# Altium project unisat_gs_hw.PrjPCB
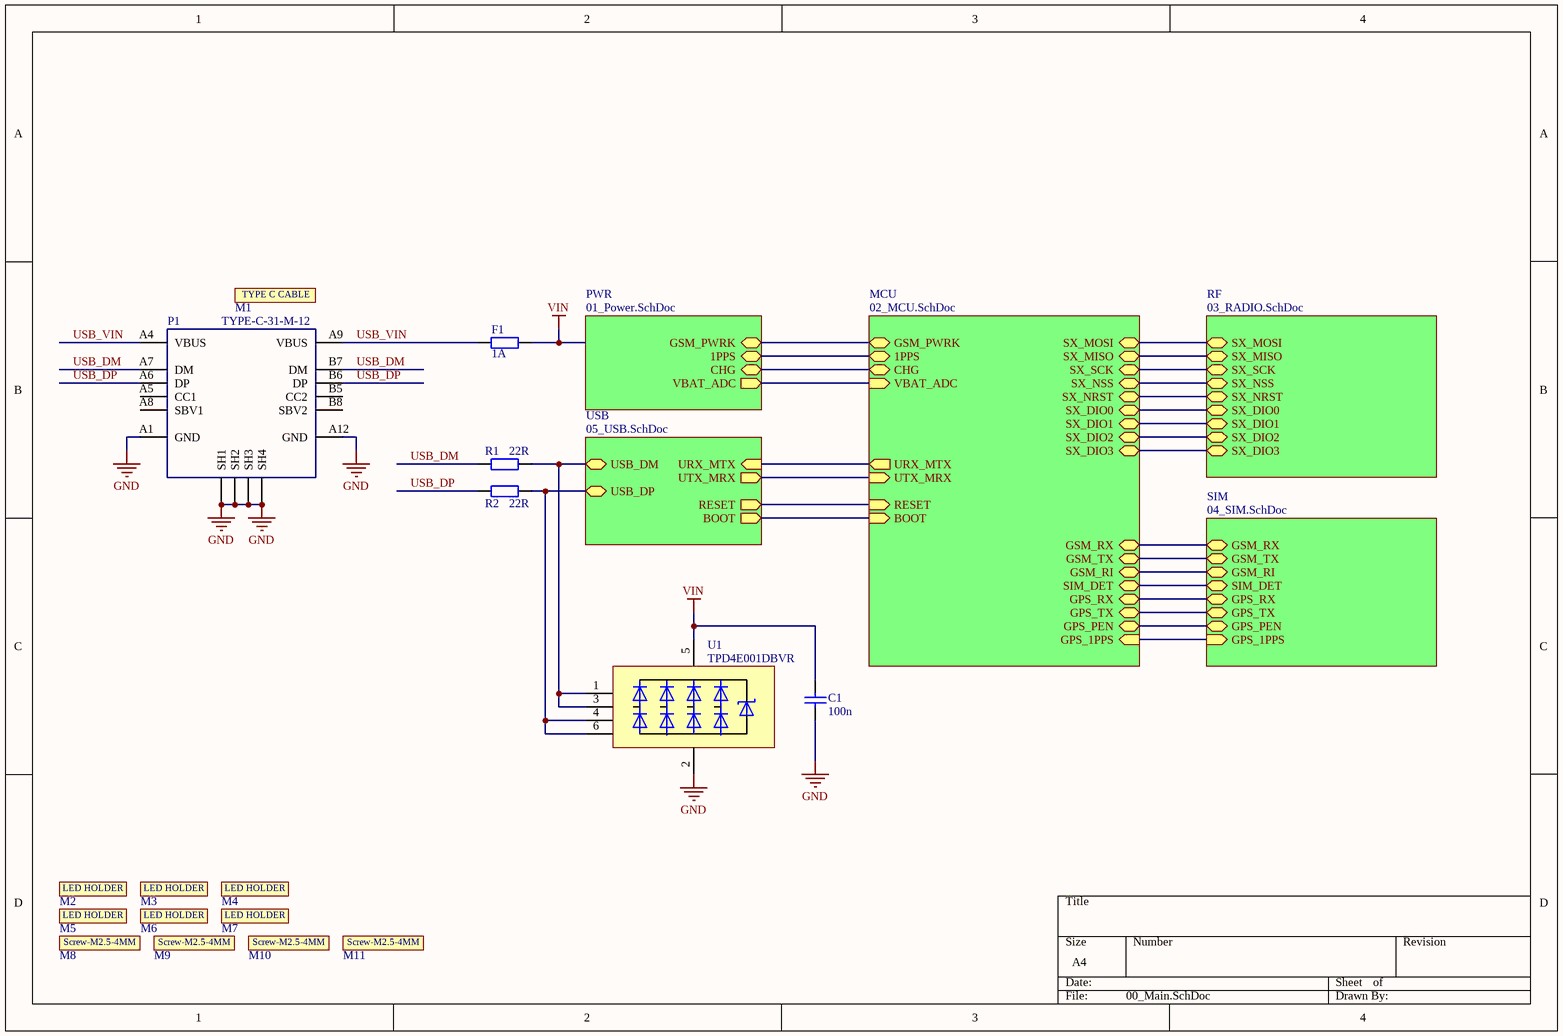
[diagram p0: 00_Main.SchDoc]
hwver: v02
5 sheets, 73 parts. Net scope: hierarchical (ports join the sheet entries above them; power ports are global).
Board file: unisat_gs_board.PcbDoc
Sheets:
  00_Main.SchDoc
    USB = 05_USB.SchDoc
    SIM = 04_SIM.SchDoc
    MCU = 02_MCU.SchDoc
    RF = 03_RADIO.SchDoc

## Sheet 00_Main.SchDoc
size A4

### Parts
C1  100n  [C0603_IPC_MD]
F1  1A  [R0603_IPC_MD]
M1  UGREEN-PVC-TYPE-C  (value not drawn)  (mechanical)
M2  LedHolderM3  (value not drawn)  (mechanical)
M3  LedHolderM3  (value not drawn)  (mechanical)
M4  LedHolderM3  (value not drawn)  (mechanical)
M5  C94096  [LED3MM_HOLDER]  (value not drawn)  (mechanical)
M6  C94096  [LED3MM_HOLDER]  (value not drawn)  (mechanical)
M7  C94096  [LED3MM_HOLDER]  (value not drawn)  (mechanical)
M8  ScrewST-M3-6MM  (value not drawn)  (mechanical)
M9  ScrewST-M3-6MM  (value not drawn)  (mechanical)
M10  ScrewST-M3-6MM  (value not drawn)  (mechanical)
M11  ScrewST-M3-6MM  (value not drawn)  (mechanical)
P1  TYPE-C-31-M-12  [TYPE-C-C165948]
R1  22R  [R0603_IPC_MD]
R2  22R  [R0603_IPC_MD]
U1  TPD4E001DBVR  [SOT23-6]

### Sub-sheets
MCU = 02_MCU.SchDoc: GSM_PWRK, URX_MTX (out), UTX_MRX (in), SX_MOSI, SX_MISO, SX_SCK, SX_NSS, SX_NRST, SX_DIO1, SX_DIO2, SX_DIO3, SX_DIO0, GSM_RX, GSM_TX, GSM_RI, GPS_RX, GPS_TX, GPS_PEN, GPS_1PPS (in), SIM_DET, 1PPS, CHG, RESET (in), BOOT (in), VBAT_ADC (in)
PWR = 01_Power.SchDoc (file not in this document): GSM_PWRK, 1PPS, CHG, VBAT_ADC (out)
RF = 03_RADIO.SchDoc: SX_MOSI, SX_MISO, SX_SCK, SX_NSS, SX_NRST, SX_DIO0, SX_DIO1, SX_DIO2, SX_DIO3
SIM = 04_SIM.SchDoc: GSM_RX, GSM_TX, GSM_RI, GPS_RX, GPS_TX, GPS_PEN, GPS_1PPS (in), SIM_DET
USB = 05_USB.SchDoc: USB_DP, USB_DM, URX_MTX (in), UTX_MRX (out), RESET (out), BOOT (out)

### Nets
GND: C1.2 P1.A1(GND) P1.A12(GND) P1.SH1 P1.SH2 P1.SH3 P1.SH4 U1.2(GND)
VIN: C1.1 F1.2 U1.5(VCC)
BOOT: sheet USB/BOOT, sheet MCU/BOOT
RESET: sheet USB/RESET, sheet MCU/RESET
SIM_DET: sheet SIM/SIM_DET, sheet MCU/SIM_DET
SX_DIO0: sheet MCU/SX_DIO0, sheet RF/SX_DIO0
SX_DIO1: sheet MCU/SX_DIO1, sheet RF/SX_DIO1
SX_DIO2: sheet MCU/SX_DIO2, sheet RF/SX_DIO2
SX_DIO3: sheet MCU/SX_DIO3, sheet RF/SX_DIO3
SX_MISO: sheet MCU/SX_MISO, sheet RF/SX_MISO
SX_MOSI: sheet MCU/SX_MOSI, sheet RF/SX_MOSI
SX_NRST: sheet MCU/SX_NRST, sheet RF/SX_NRST
SX_NSS: sheet MCU/SX_NSS, sheet RF/SX_NSS
SX_SCK: sheet MCU/SX_SCK, sheet RF/SX_SCK
URX_MTX: sheet USB/URX_MTX, sheet MCU/URX_MTX
USB_DM: P1.A7(DM) P1.B7(DM) R1.1
USB_DP: P1.A6(DP) P1.B6(DP) R2.1
USB_VIN: F1.1 P1.A4(VBUS) P1.A9(VBUS)
UTX_MRX: sheet USB/UTX_MRX, sheet MCU/UTX_MRX
NetR1_2: R1.2 U1.1(IO1) U1.3(IO2) ; sheet USB/USB_DM
NetR2_2: R2.2 U1.4(IO3) U1.6(IO4) ; sheet USB/USB_DP
NetR21_1: sheet SIM/GSM_RI, sheet MCU/GSM_RI
NetR22_1: sheet SIM/GSM_RX, sheet MCU/GSM_RX
NetR23_1: sheet SIM/GSM_TX, sheet MCU/GSM_TX
NetR26_1: sheet SIM/GPS_PEN, sheet MCU/GPS_PEN
NetR29_1: sheet SIM/GPS_1PPS, sheet MCU/GPS_1PPS
NetR30_1: sheet SIM/GPS_RX, sheet MCU/GPS_RX
NetR31_1: sheet SIM/GPS_TX, sheet MCU/GPS_TX
NetU4_11: sheet PWR/VBAT_ADC, sheet MCU/VBAT_ADC
NetU4_44: sheet PWR/CHG, sheet MCU/CHG
NetU4_45: sheet PWR/GSM_PWRK, sheet MCU/GSM_PWRK
NetU4_61: sheet PWR/1PPS, sheet MCU/1PPS

Not connected (* = marked no-connect by the designer): P1 A5(CC1) A8(SBV1) B5(CC2) B8(SBV2)

### Notes on the sheet
- (in symbol C94096) LED HOLDER
- (in symbol LED-HOLDER-M3) LED HOLDER
- (in symbol ScrewST-M3-6MM) Screw-M2.5-4MM
- (in symbol TYPE-C-CABLE) TYPE C CABLE

### Library data of the parts
C1 = CL10B104KO8NNNC: CAP CER 0.1UF 16V X7R 0603; Manufacturer: Samsung Electro-Mechanics; Manufacturer Part Number: CL10B104KO8NNNC; Voltage: 16V; Value: 100n; Dielectric: X7R; Supplier 1: Digi-Key; Supplier Part Number 1: 1276-1005-1-ND
F1 = MFU0603FF01000P500: FUSE BOARD MOUNT 1A 32VDC 0603; Manufacturer: Bourns Inc.; Value: 1A; Manufacturer Part Number: MFU0603FF01000P500; Supplier 1: Digi-Key; Supplier Part Number 1: 749-1742-1-ND
M1 = TYPE-C-CABLE: Ugreen USB Type C Cable; Manufacturer: China; Manufacturer Part Number: UGREEN-PVC-TYPE-C; Supplier 1: Aliexpress; Supplier Part Number 1: UGREEN-PVC-TYPE-C; Link: https://www.aliexpress.com/item/32421088643.html?spm=2114.12010612.8148356.8.24b5310anwdN5o
M2-M4 = LED-HOLDER-M3: Manufacturer: China; Manufacturer Part Number: LedHolderM3; Supplier 1: Aliexpress; Supplier Part Number 1: LedHolderM3
M5-M7 = C94096: LED Light Pipes 4*10 RoHS; Manufacturer: HIWA; Manufacturer Part Number: C94096; Supplier 1: LCSC; Supplier Part Number 1: C94096
M8-M11 = ScrewST-M3-6MM: Manufacturer: China; Manufacturer Part Number: ScrewST-M3-6MM; Supplier 1: Aliexpress; Supplier Part Number 1: ScrewST-M3-6MM
P1 = TYPE-C-31-M-12: TYPE C PCB TH CONN; Manufacturer: Korean Hroparts Elec; Manufacturer Part Number: TYPE-C-31-M-12; Supplier 1: LCSC; Supplier Part Number 1: C165948
R1 R2 = CR0603-JW-220ELF: RES SMD 22 OHM 5% 1/10W 0603; Manufacturer: Bourns Inc.; Value: 22R; Tolarance: 5%; Manufacturer Part Number: CR0603-JW-220ELF; Supplier 1: Digi-Key; Supplier Part Number 1: CR0603-JW-220ELFCT-ND
U1 = TPD4E001DBVR: 4x TVS DIODE 5.5V SOT23-6; Manufacturer: TI; Manufacturer Part Number: TPD4E001DBVR; Supplier 1: Digi-Key; Supplier Part Number 1: 296-28203-1-ND

## Sheet 05_USB.SchDoc
size A4; Revision: A
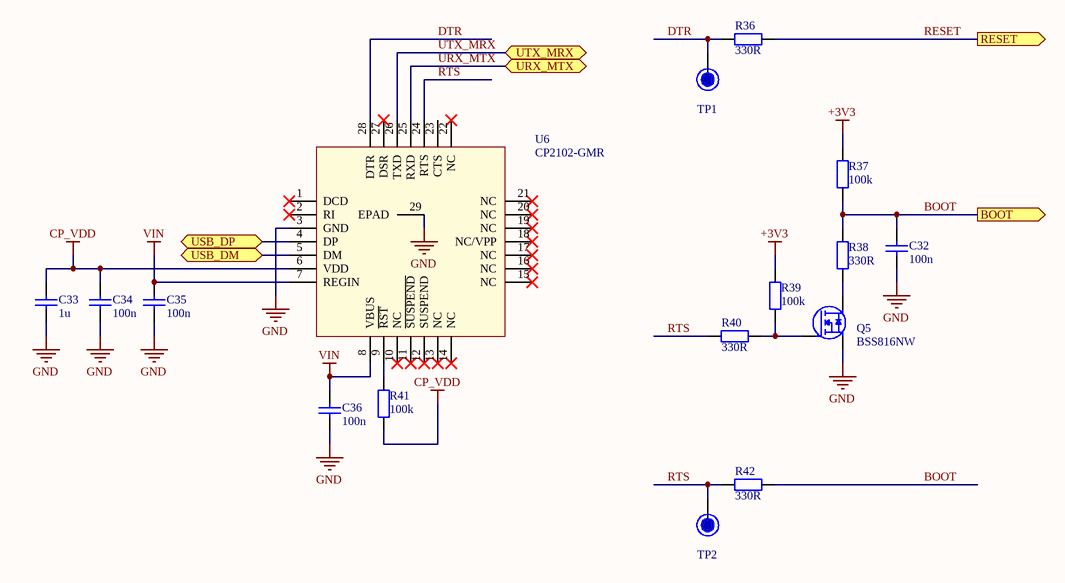
[diagram p1: 05_USB.SchDoc]

### Parts
C32  100n  [C0603_IPC_MD]  (no BOM)
C33  1u  [C0603_IPC_MD]
C34  100n  [C0603_IPC_MD]
C35  100n  [C0603_IPC_MD]
C36  100n  [C0603_IPC_MD]
Q5  BSS816NW  [SOT323]  (no BOM)
R36  330R  [R0603_IPC_MD]
R37  100k  [R0603_IPC_MD]  (no BOM)
R38  330R  [R0603_IPC_MD]  (no BOM)
R39  100k  [R0603_IPC_MD]  (no BOM)
R40  330R  [R0603_IPC_MD]  (no BOM)
R41  100k  [R0603_IPC_MD]
R42  330R  [R0603_IPC_MD]
TP1  RTS  [TestPoint_1M5]  (value not drawn)  (no BOM)
TP2  DTR  [TestPoint_1M5]  (value not drawn)  (no BOM)
U6  CP2102-GMR  [QFN28_(SL)]

### Ports
BOOT (out), RESET (out), URX_MTX, USB_DM, USB_DP, UTX_MRX

### Nets
+3V3: R37.2 R39.2
CP_VDD: C33.2 C34.2 R41.1 U6.6(VDD)
GND: C32.1 C33.1 C34.1 C35.1 C36.1 Q5.2(S) U6.3(GND) U6.29(EPAD)
VIN: C35.2 C36.2 U6.7(REGIN) U6.8(VBUS)
BOOT: C32.2 R37.1 R38.1 R42.2 ; port BOOT
DTR: R36.2 TP1.0 U6.28(DTR)
RESET: R36.1 ; port RESET
RTS: R40.1 R42.1 TP2.0 U6.24(RTS)
URX_MTX: U6.25(RXD) ; port URX_MTX
UTX_MRX: U6.26(TXD) ; port UTX_MRX
NetQ5_1: Q5.1(G) R39.1 R40.2
NetQ5_3: Q5.3(D) R38.2
NetR1_2: U6.5(DM) ; port USB_DM
NetR2_2: U6.4(DP) ; port USB_DP
NetR41_2: R41.2 U6.9(~{RST})

Not connected (* = marked no-connect by the designer): U6 1(DCD)* 2(RI)* 10(NC)* 11(~{SUSPEND})* 12(SUSPEND)* 13(NC)* 14(NC)* 15(NC)* 16(NC)* 17(NC)* 18(NC/VPP)* 19(NC)* 20(NC)* 21(NC)* 22(NC)* 23(CTS) 27(DSR)*

### Notes on the sheet
- Title
- Size:
- Date:
- A4
- Number:
- Time:
- Revision:
- Sheet
- of
- File:

### Library data of the parts
C32 C34-C36 = CL10B104KO8NNNC: as C1 on sheet 00_Main; Manufacturer Part Number: CL10B104KO8NNNC; Voltage: 16V; Value: 100n; Dielectric: X7R; Supplier 1: Digi-Key; Supplier Part Number 1: 1276-1005-1-ND
C33 = CL10B105MO8NNWC: CAP CER 1UF 16V X7R 0603; Manufacturer: Samsung Electro-Mechanics; Manufacturer Part Number: CL10B105MO8NNWC; Voltage: 16V; Value: 1u; Dielectric: X7R; Supplier 1: Digi-Key; Supplier Part Number 1: 1276-6524-1-ND
Q5 = BSS816: N-Channel Logic Level Enhancement Mode Field Effect Transistor; Manufacturer: Infineon Technologies; Manufacturer Part Number: BSS816NW; Supplier 1: Digi-Key; Supplier Part Number 1: BSS816NWH6327XTSA1CT-ND
R36 R38 R40 R42 = CR0603-JW-331ELF: RES SMD 330 OHM 5% 1/10W 0603; Manufacturer: Bourns Inc.; Value: 330R; Tolarance: 5%; Manufacturer Part Number: CR0603-JW-331ELF; Supplier 1: Digi-Key; Supplier Part Number 1: CR0603-JW-331ELFCT-ND
R37 R39 R41 = RMCF0603FT100K: RES 100K OHM 1% 1/10W 0603; Manufacturer: Bourns Inc.; Value: 100k; Tolarance: 1%; Manufacturer Part Number: RMCF0603FT100K; Supplier 1: Digi-Key; Supplier Part Number 1: RMCF0603FT100KCT-ND
TP1 TP2 = TP: Test Point
U6 = CP2102-GMR: IC USB-TO-UART BRIDGE 28VQFN; Manufacturer: Silicon Labs; Manufacturer Part Number: CP2102-GMR; Supplier 1: Digi-Key; Supplier Part Number 1: 336-1160-1-ND

## Sheet 04_SIM.SchDoc
size A4
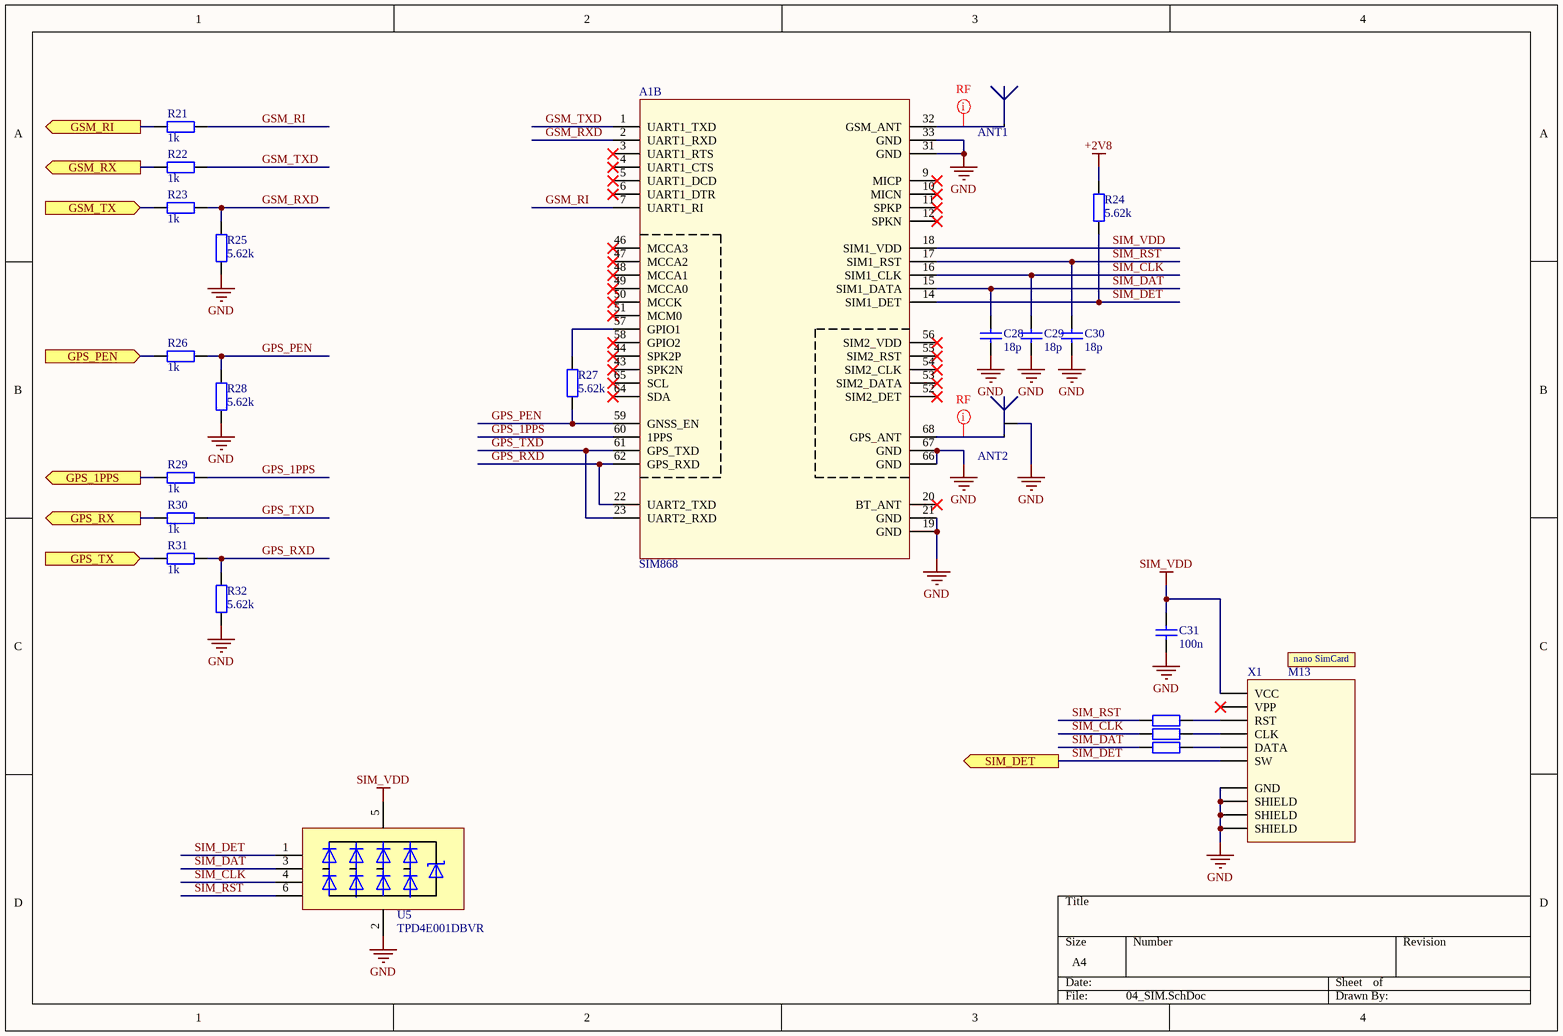
[diagram p2: 04_SIM.SchDoc]

### Parts
A1  SIM868  [SIM868]  (part B of 2)
ANT1  W3070  [W3070]  (value not drawn)
ANT2  ANT3216LL15R1575A  [ANT3216LL15]  (value not drawn)
C28  18p  [C0603_IPC_MD]
C29  18p  [C0603_IPC_MD]
C30  18p  [C0603_IPC_MD]
C31  100n  [C0603_IPC_MD]
M13  SIMCARD-NANO  (value not drawn)  (mechanical)
R21  1k  [R0603_IPC_MD]
R22  1k  [R0603_IPC_MD]
R23  1k  [R0603_IPC_MD]
R24  5.62k  [R0603_IPC_MD]
R25  5.62k  [R0603_IPC_MD]
R26  1k  [R0603_IPC_MD]
R27  5.62k  [R0603_IPC_MD]
R28  5.62k  [R0603_IPC_MD]
R29  1k  [R0603_IPC_MD]
R30  1k  [R0603_IPC_MD]
R31  1k  [R0603_IPC_MD]
R32  5.62k  [R0603_IPC_MD]
R33  22R  [R0603_IPC_MD]  (value not drawn)
R34  22R  [R0603_IPC_MD]  (value not drawn)
R35  22R  [R0603_IPC_MD]  (value not drawn)
U5  TPD4E001DBVR  [SOT23-6]
X1  SNO-1305-B  [SNO-1305-B]  (value not drawn)

### Ports
GPS_1PPS (out), GPS_PEN (in), GPS_RX (out), GPS_TX (in), GSM_RI (out), GSM_RX (out), GSM_TX (in), SIM_DET (out)

### Nets
+2V8: R24.2
GND: A1.19(GND) A1.21(GND) A1.31(GND) A1.33(GND) A1.66(GND) A1.67(GND) ANT2.2 C28.1 C29.1 C30.1 C31.1 R25.1 R28.1 R32.1 U5.2(GND) X1.C5(GND) X1.S1(SHIELD) X1.S2(SHIELD) X1.S3(SHIELD)
SIM_VDD: A1.18(SIM1_VDD) C31.2 U5.5(VCC) X1.C1(VCC)
GPS_1PPS: A1.60(1PPS) R29.2
GPS_PEN: A1.59(GNSS_EN) R26.2 R27.1 R28.2
GPS_RXD: A1.22(UART2_TXD) A1.62(GPS_RXD) R31.2 R32.2
GPS_TXD: A1.23(UART2_RXD) A1.61(GPS_TXD) R30.2
GSM_RI: A1.7(UART1_RI) R21.2
GSM_RXD: A1.2(UART1_RXD) R23.2 R25.2
GSM_TXD: A1.1(UART1_TXD) R22.2
SIM_CLK: A1.16(SIM1_CLK) C29.2 R34.1 U5.4(IO3)
SIM_DAT: A1.15(SIM1_DATA) C28.2 R35.1 U5.3(IO2)
SIM_DET: A1.14(SIM1_DET) R24.1 U5.1(IO1) X1.SW ; port SIM_DET
SIM_RST: A1.17(SIM1_RST) C30.2 R33.1 U5.6(IO4)
NetA1_32: A1.32(GSM_ANT) ANT1.1
NetA1_57: A1.57(GPIO1) R27.2
NetA1_68: A1.68(GPS_ANT) ANT2.1
NetR21_1: R21.1 ; port GSM_RI
NetR22_1: R22.1 ; port GSM_RX
NetR23_1: R23.1 ; port GSM_TX
NetR26_1: R26.1 ; port GPS_PEN
NetR29_1: R29.1 ; port GPS_1PPS
NetR30_1: R30.1 ; port GPS_RX
NetR31_1: R31.1 ; port GPS_TX
NetR33_2: R33.2 X1.C2(RST)
NetR34_2: R34.2 X1.C3(CLK)
NetR35_2: R35.2 X1.C7(DATA)

Not connected (* = marked no-connect by the designer): A1 3(UART1_RTS)* 4(UART1_CTS)* 5(UART1_DCD)* 6(UART1_DTR)* 9(MICP)* 10(MICN)* 11(SPKP)* 12(SPKN)* 20(BT_ANT)* 43(SPK2N)* 44(SPK2P)* 46(MCCA3)* 47(MCCA2)* 48(MCCA1)* 49(MCCA0)* 50(MCCK)* 51(MCM0)* 52(SIM2_DET)* 53(SIM2_DATA)* 54(SIM2_CLK)* 55(SIM2_RST)* 56(SIM2_VDD)* 58(GPIO2)* 64(SDA)* 65(SCL)*; X1 C6(VPP)*

### Layout directives
net class RF50: NetA1_32, NetA1_68

### Notes on the sheet
- (in symbol SIMCARD-NANO) nano SimCard

### Library data of the parts
A1 = SIM868: GSM & GPRS & GPS Modules PCBModule RoHS; Manufacturer: SIMCom Wireless Solutions; Manufacturer Part Number: SIM868; Supplier 1: LCSC; Supplier Part Number 1: C89549
ANT1 = W3070: RF ANT 900MHZ/1.8GHZ CHIP SLD; Manufacturer: PulseLarsen Antennas; Manufacturer Part Number: W3070; Supplier 1: Digi-Key; Supplier Part Number 1: 553-1695-1-ND
ANT2 = ANT3216LL15R1575A: RF ANT 1.575GHZ CHIP SOLDER SMD; Manufacturer: Yageo; Manufacturer Part Number: ANT3216LL15R1575A; Supplier 1: Digi-Key; Supplier Part Number 1: 311-1543-1-ND
C28-C30 = CL10C180JB8NNNC: CAP CER 18PF 50V C0G/NP0 0603; Manufacturer: Samsung Electro-Mechanics; Manufacturer Part Number: CL10C180JB8NNNC; Voltage: 50V; Value: 18p; Dielectric: C0G/NP0; Supplier 1: Digi-Key; Supplier Part Number 1: 1276-1089-1-ND
C31 = CL10B104KO8NNNC: as C1 on sheet 00_Main; Manufacturer Part Number: CL10B104KO8NNNC; Voltage: 16V; Value: 100n; Dielectric: X7R; Supplier 1: Digi-Key; Supplier Part Number 1: 1276-1005-1-ND
M13 = SIMCARD-NANO: Nano SimCard; Manufacturer: Beeline; Manufacturer Part Number: SIMCARD-NANO; Supplier 1: Beeline; Supplier Part Number 1: SIMCARD-NANO
R21-R23 R26 R29-R31 = CR0603-JW-102ELF: RES SMD 1K OHM 5% 1/10W 0603; Manufacturer: Bourns Inc.; Value: 1k; Tolarance: 5%; Manufacturer Part Number: CR0603-JW-102ELF; Supplier 1: Digi-Key; Supplier Part Number 1: CR0603-JW-102ELFCT-ND
R24 R25 R27 R28 R32 = CR0603-JW-5.62kR: RES 5.62K OHM 1% 1/10W 0603; Manufacturer: Stackpole Electronics Inc; Manufacturer Part Number: RMCF0603FT5K62; Value: 5.62k; Tolarance: ±1%; Supplier 1: Digi-Key; Supplier Part Number 1: RMCF0603FT5K62CT-ND
R33-R35 = CR0603-JW-220ELF: as R1 on sheet 00_Main; Value: 22R; Tolarance: 5%; Manufacturer Part Number: CR0603-JW-220ELF; Supplier 1: Digi-Key; Supplier Part Number 1: CR0603-JW-220ELFCT-ND
U5 = TPD4E001DBVR: as U1 on sheet 00_Main; Manufacturer Part Number: TPD4E001DBVR; Supplier 1: Digi-Key; Supplier Part Number 1: 296-28203-1-ND
X1 = SNO-1305-B: Hinged Sim Card Connector. With 6 contacts, with switch for card detection. Profile above PCB is 1.43mm.; Manufacturer: SOFNG; Manufacturer Part Number: SNO-1305-B; Supplier 1: LCSC; Supplier Part Number 1: C111371

## Sheet 02_MCU.SchDoc
size A4
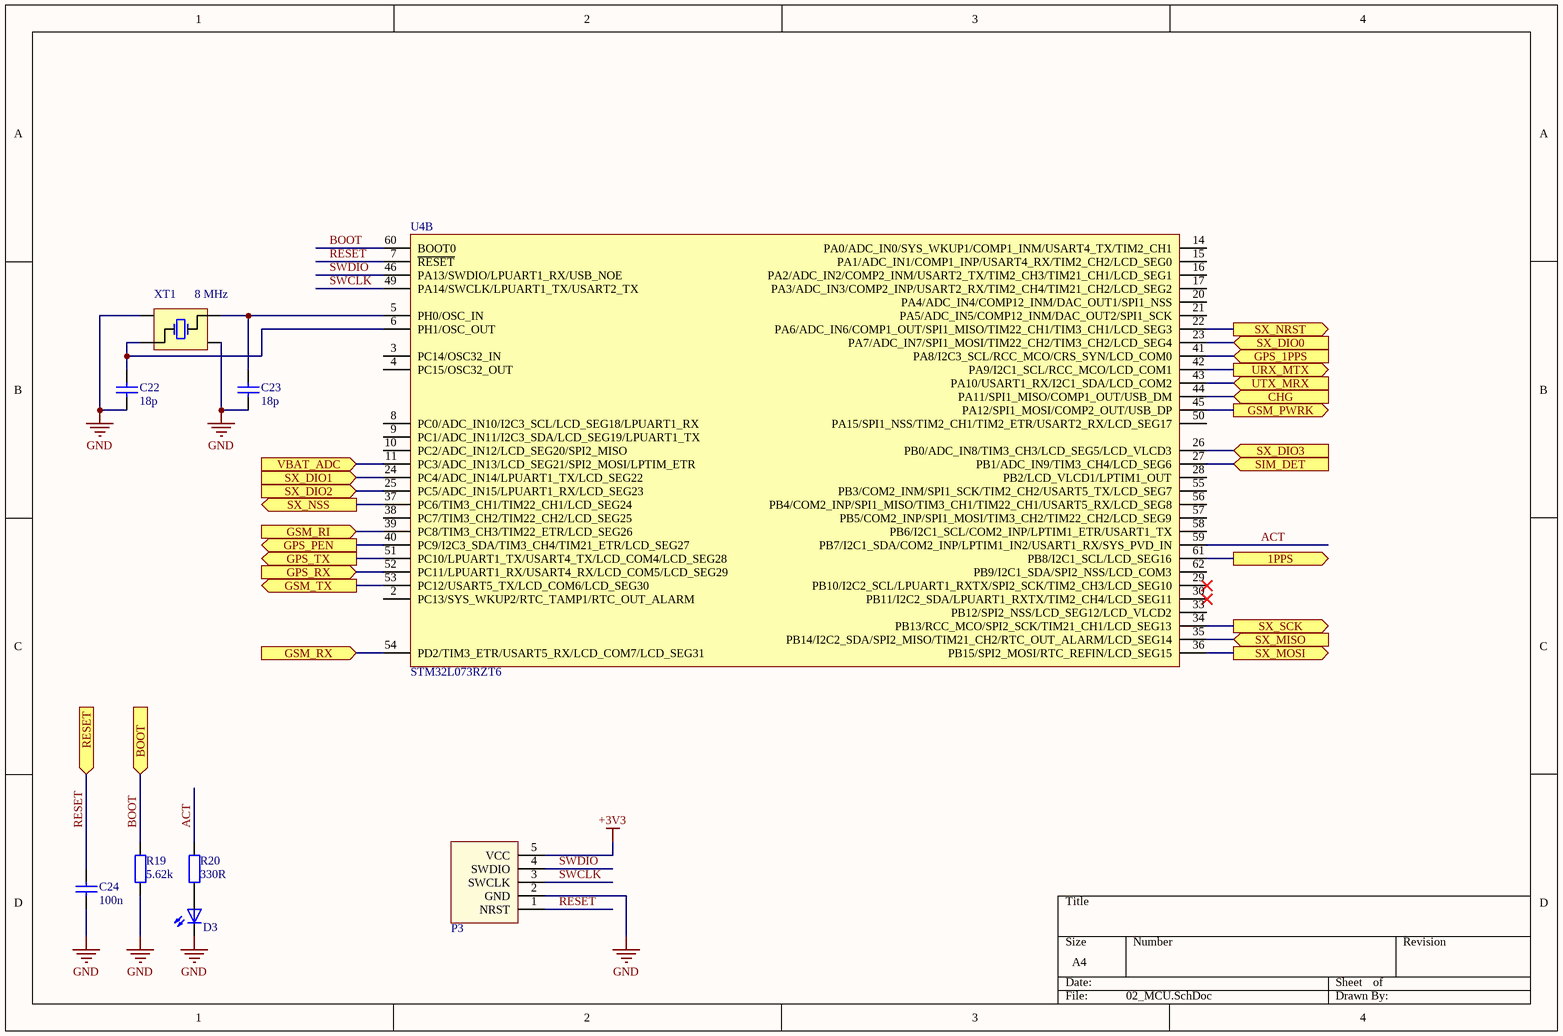
[diagram p3: 02_MCU.SchDoc]

### Parts
C22  18p  [C0603_IPC_MD]
C23  18p  [C0603_IPC_MD]
C24  100n  [C0603_IPC_MD]
D3  LTL-4231N  [LED3MM_HOLDER]  (value not drawn)
P3  SWD  [SWD_CON_VAR2]  (value not drawn)  (no BOM)
R19  5.62k  [R0603_IPC_MD]
R20  330R  [R0603_IPC_MD]
U4  STM32L073RZT6  [LQFP64_10X10MM]  (part B of 2)
XT1  8 MHz  [5.0X3.2_4PAD_SMT]

### Ports
1PPS (out), BOOT (in), CHG (in), GPS_1PPS (in), GPS_PEN (out), GPS_RX (in), GPS_TX (out), GSM_PWRK (out), GSM_RI (in), GSM_RX (in), GSM_TX (out), RESET (in), SIM_DET (in), SX_DIO0 (in), SX_DIO1 (in), SX_DIO2 (in), SX_DIO3 (in), SX_MISO (in), SX_MOSI (out), SX_NRST (out), SX_NSS (out), SX_SCK (out), URX_MTX (out), UTX_MRX (in), VBAT_ADC (in)

### Nets
+3V3: P3.5(VCC)
GND: C22.1 C23.1 C24.1 D3.1(C) P3.2(GND) R19.1 XT1.2(NC) XT1.4(NC)
ACT: R20.1 U4.59(PB7/I2C1_SDA/COM2_INP/LPTIM1_IN2/USART1_RX/SYS_PVD_IN)
BOOT: R19.2 U4.60(BOOT0) ; port BOOT
RESET: C24.2 P3.1(NRST) U4.7(~{RESET}) ; port RESET
SIM_DET: U4.27(PB1/ADC_IN9/TIM3_CH4/LCD_SEG6) ; port SIM_DET
SWCLK: P3.3(SWCLK) U4.49(PA14/SWCLK/LPUART1_TX/USART2_TX)
SWDIO: P3.4(SWDIO) U4.46(PA13/SWDIO/LPUART1_RX/USB_NOE)
SX_DIO0: U4.23(PA7/ADC_IN7/SPI1_MOSI/TIM22_CH2/TIM3_CH2/LCD_SEG4) ; port SX_DIO0
SX_DIO1: U4.24(PC4/ADC_IN14/LPUART1_TX/LCD_SEG22) ; port SX_DIO1
SX_DIO2: U4.25(PC5/ADC_IN15/LPUART1_RX/LCD_SEG23) ; port SX_DIO2
SX_DIO3: U4.26(PB0/ADC_IN8/TIM3_CH3/LCD_SEG5/LCD_VLCD3) ; port SX_DIO3
SX_MISO: U4.35(PB14/I2C2_SDA/SPI2_MISO/TIM21_CH2/RTC_OUT_ALARM/LCD_SEG14) ; port SX_MISO
SX_MOSI: U4.36(PB15/SPI2_MOSI/RTC_REFIN/LCD_SEG15) ; port SX_MOSI
SX_NRST: U4.22(PA6/ADC_IN6/COMP1_OUT/SPI1_MISO/TIM22_CH1/TIM3_CH1/LCD_SEG3) ; port SX_NRST
SX_NSS: U4.37(PC6/TIM3_CH1/TIM22_CH1/LCD_SEG24) ; port SX_NSS
SX_SCK: U4.34(PB13/RCC_MCO/SPI2_SCK/TIM21_CH1/LCD_SEG13) ; port SX_SCK
URX_MTX: U4.42(PA9/I2C1_SCL/RCC_MCO/LCD_COM1) ; port URX_MTX
UTX_MRX: U4.43(PA10/USART1_RX/I2C1_SDA/LCD_COM2) ; port UTX_MRX
NetC22_2: C22.2 U4.6(PH1/OSC_OUT) XT1.1(OSC1)
NetC23_2: C23.2 U4.5(PH0/OSC_IN) XT1.3(OSC2)
NetD3_2: D3.2(A) R20.2
NetR21_1: U4.39(PC8/TIM3_CH3/TIM22_ETR/LCD_SEG26) ; port GSM_RI
NetR22_1: U4.54(PD2/TIM3_ETR/USART5_RX/LCD_COM7/LCD_SEG31) ; port GSM_RX
NetR23_1: U4.53(PC12/USART5_TX/LCD_COM6/LCD_SEG30) ; port GSM_TX
NetR26_1: U4.40(PC9/I2C3_SDA/TIM3_CH4/TIM21_ETR/LCD_SEG27) ; port GPS_PEN
NetR29_1: U4.41(PA8/I2C3_SCL/RCC_MCO/CRS_SYN/LCD_COM0) ; port GPS_1PPS
NetR30_1: U4.52(PC11/LPUART1_RX/USART4_RX/LCD_COM5/LCD_SEG29) ; port GPS_RX
NetR31_1: U4.51(PC10/LPUART1_TX/USART4_TX/LCD_COM4/LCD_SEG28) ; port GPS_TX
NetU4_11: U4.11(PC3/ADC_IN13/LCD_SEG21/SPI2_MOSI/LPTIM_ETR) ; port VBAT_ADC
NetU4_44: U4.44(PA11/SPI1_MISO/COMP1_OUT/USB_DM) ; port CHG
NetU4_45: U4.45(PA12/SPI1_MOSI/COMP2_OUT/USB_DP) ; port GSM_PWRK
NetU4_61: U4.61(PB8/I2C1_SCL/LCD_SEG16) ; port 1PPS

Not connected (* = marked no-connect by the designer): U4 2(PC13/SYS_WKUP2/RTC_TAMP1/RTC_OUT_ALARM) 3(PC14/OSC32_IN) 4(PC15/OSC32_OUT) 8(PC0/ADC_IN10/I2C3_SCL/LCD_SEG18/LPUART1_RX) 9(PC1/ADC_IN11/I2C3_SDA/LCD_SEG19/LPUART1_TX) 10(PC2/ADC_IN12/LCD_SEG20/SPI2_MISO) 14(PA0/ADC_IN0/SYS_WKUP1/COMP1_INM/USART4_TX/TIM2_CH1) 15(PA1/ADC_IN1/COMP1_INP/USART4_RX/TIM2_CH2/LCD_SEG0) 16(PA2/ADC_IN2/COMP2_INM/USART2_TX/TIM2_CH3/TIM21_CH1/LCD_SEG1) 17(PA3/ADC_IN3/COMP2_INP/USART2_RX/TIM2_CH4/TIM21_CH2/LCD_SEG2) 20(PA4/ADC_IN4/COMP12_INM/DAC_OUT1/SPI1_NSS) 21(PA5/ADC_IN5/COMP12_INM/DAC_OUT2/SPI1_SCK) 28(PB2/LCD_VLCD1/LPTIM1_OUT) 29(PB10/I2C2_SCL/LPUART1_RXTX/SPI2_SCK/TIM2_CH3/LCD_SEG10)* 30(PB11/I2C2_SDA/LPUART1_RXTX/TIM2_CH4/LCD_SEG11)* 33(PB12/SPI2_NSS/LCD_SEG12/LCD_VLCD2) 38(PC7/TIM3_CH2/TIM22_CH2/LCD_SEG25) 50(PA15/SPI1_NSS/TIM2_CH1/TIM2_ETR/USART2_RX/LCD_SEG17) 55(PB3/COM2_INM/SPI1_SCK/TIM2_CH2/USART5_TX/LCD_SEG7) 56(PB4/COM2_INP/SPI1_MISO/TIM3_CH1/TIM22_CH1/USART5_RX/LCD_SEG8) 57(PB5/COM2_INP/SPI1_MOSI/TIM3_CH2/TIM22_CH2/LCD_SEG9) 58(PB6/I2C1_SCL/COM2_INP/LPTIM1_ETR/USART1_TX) 62(PB9/I2C1_SDA/SPI2_NSS/LCD_COM3)

### Library data of the parts
C22 C23 = CL10C180JB8NNNC: as C28 on sheet 04_SIM; Manufacturer Part Number: CL10C180JB8NNNC; Voltage: 50V; Value: 18p; Dielectric: C0G/NP0; Supplier 1: Digi-Key; Supplier Part Number 1: 1276-1089-1-ND
C24 = CL10B104KO8NNNC: as C1 on sheet 00_Main; Manufacturer Part Number: CL10B104KO8NNNC; Voltage: 16V; Value: 100n; Dielectric: X7R; Supplier 1: Digi-Key; Supplier Part Number 1: 1276-1005-1-ND
D3 = LTL-4231N: Light Emitting Diodes (LED) Green 569nm 12.6mcd@10mA Top View DIP3mm RoHS; Manufacturer: Lite-On; Manufacturer Part Number: LTL-4231N; Supplier 1: LCSC; Supplier Part Number 1: C125082
P3 = SWD-CONNECTOR_VAR1: SWDIO SWCLK VDD GND NRST; Manufacturer: *; Manufacturer Part Number: *; Supplier 1: *; Supplier Part Number 1: *
R19 = CR0603-JW-5.62kR: as R24 on sheet 04_SIM; Value: 5.62k; Tolarance: ±1%; Supplier 1: Digi-Key; Supplier Part Number 1: RMCF0603FT5K62CT-ND
R20 = CR0603-JW-331ELF: as R36 on sheet 05_USB; Value: 330R; Tolarance: 5%; Manufacturer Part Number: CR0603-JW-331ELF; Supplier 1: Digi-Key; Supplier Part Number 1: CR0603-JW-331ELFCT-ND
U4 = STM32L073RZT6: Ultra-low-power 32-bit MCU ARM®-based Cortex®-M0+; Manufacturer: ST; SRAM: 20KB; FLASH: 192KB; Manufacturer Part Number: STM32L073RZT6; Supplier 1: Digi-Key; Supplier Part Number 1: 497-16270-ND
XT1 = ABM3B-8.000MHZ-10-1-U-T: 8MHz ±10ppm Crystal 10pF 200 Ohms 4-SMD, No Lead; Manufacturer: Abracon LLC; Manufacturer Part Number: ABM3B-8.000MHZ-10-1-U-T; Type: XTAL; Value: 8 MHz; Supplier 1: Digi-Key; Supplier Part Number 1: 535-9721-1-ND

## Sheet 03_RADIO.SchDoc
size A4
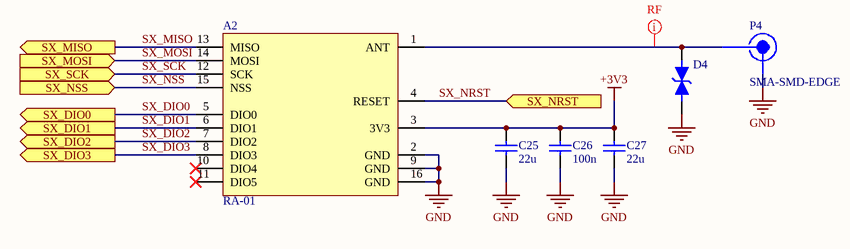
[diagram p4: 03_RADIO.SchDoc]

### Parts
A2  RA-01  [RA-01]
C25  22u  [C0805_IPC_HD]
C26  100n  [C0603_IPC_MD]
C27  22u  [C0805_IPC_HD]
D4  LXES15AAA1-153  [C0402_IPC_MD]  (value not drawn)  (no BOM)
P4  SMA-SMD-EDGE  [SMA-SMD-EDGE]

### Ports
SX_DIO0 (out), SX_DIO1 (out), SX_DIO2 (out), SX_DIO3 (out), SX_MISO (out), SX_MOSI (in), SX_NRST (in), SX_NSS (in), SX_SCK (in)

### Nets
+3V3: A2.3(3V3) C25.1 C26.1 C27.1
GND: A2.2(GND) A2.9(GND) A2.16(GND) C25.2 C26.2 C27.2 D4.1 P4.1
SX_DIO0: A2.5(DIO0) ; port SX_DIO0
SX_DIO1: A2.6(DIO1) ; port SX_DIO1
SX_DIO2: A2.7(DIO2) ; port SX_DIO2
SX_DIO3: A2.8(DIO3) ; port SX_DIO3
SX_MISO: A2.13(MISO) ; port SX_MISO
SX_MOSI: A2.14(MOSI) ; port SX_MOSI
SX_NRST: A2.4(RESET) ; port SX_NRST
SX_NSS: A2.15(NSS) ; port SX_NSS
SX_SCK: A2.12(SCK) ; port SX_SCK
NetA2_1: A2.1(ANT) D4.2 P4.2

Not connected (* = marked no-connect by the designer): A2 10(DIO4)* 11(DIO5)*

### Layout directives
net class RF50: NetA2_1

### Library data of the parts
A2 = RA-01: Wireless Modules SX1278; Manufacturer: Ai-Thinker; Manufacturer Part Number: RA-01; Supplier 1: LCSC; Supplier Part Number 1: C90040
C25 C27 = CL21A226MOCLRNC: CAP CER 22UF 16V X5R 0805; Manufacturer: Samsung Electro-Mechanics; Manufacturer Part Number: CL21A226MOCLRNC; Voltage: 16V; Value: 22u; Dielectric: X5R; Supplier 1: Digi-Key; Supplier Part Number 1: 1276-6780-1-ND
C26 = CL10B104KO8NNNC: as C1 on sheet 00_Main; Manufacturer Part Number: CL10B104KO8NNNC; Voltage: 16V; Value: 100n; Dielectric: X7R; Supplier 1: Digi-Key; Supplier Part Number 1: 1276-1005-1-ND
D4 = LXES15AAA1-153: TVS DIODE 4V 0402; Manufacturer: Murata Electronics North America; Manufacturer Part Number: LXES15AAA1-153; Voltage - Reverse Standoff (Typ): 4V; Supplier 1: Digi-Key; Supplier Part Number 1: 490-13210-1-ND
P4 = SMA-SMD-EDGE: SMA SMD EDGE CONNECTER; Manufacturer: China; Manufacturer Part Number: SMA-SMD-EDGE; Supplier 1: Aliexpress; Supplier Part Number 1: SMA-SMD-EDGE

## Nets that join several sheets
+3V3: 05_USB (R37.2 R39.2), 02_MCU (P3.5), 03_RADIO (A2.3 C25.1 C26.1 C27.1)
GND: 00_Main (8 pins), 05_USB (8 pins), 04_SIM (19 pins), 02_MCU (8 pins), 03_RADIO (8 pins)
VIN: 00_Main (C1.1 F1.2 U1.5), 05_USB (C35.2 C36.2 U6.7 U6.8)
BOOT: 05_USB (C32.2 R37.1 R38.1 R42.2), 02_MCU (R19.2 U4.60)
NetR1_2: 00_Main (R1.2 U1.1 U1.3), 05_USB (U6.5)
NetR2_2: 00_Main (R2.2 U1.4 U1.6), 05_USB (U6.4)
NetR21_1: 04_SIM (R21.1), 02_MCU (U4.39)
NetR22_1: 04_SIM (R22.1), 02_MCU (U4.54)
NetR23_1: 04_SIM (R23.1), 02_MCU (U4.53)
NetR26_1: 04_SIM (R26.1), 02_MCU (U4.40)
NetR29_1: 04_SIM (R29.1), 02_MCU (U4.41)
NetR30_1: 04_SIM (R30.1), 02_MCU (U4.52)
NetR31_1: 04_SIM (R31.1), 02_MCU (U4.51)
RESET: 05_USB (R36.1), 02_MCU (C24.2 P3.1 U4.7)
SIM_DET: 04_SIM (A1.14 R24.1 U5.1 X1.SW), 02_MCU (U4.27)
SX_DIO0: 02_MCU (U4.23), 03_RADIO (A2.5)
SX_DIO1: 02_MCU (U4.24), 03_RADIO (A2.6)
SX_DIO2: 02_MCU (U4.25), 03_RADIO (A2.7)
SX_DIO3: 02_MCU (U4.26), 03_RADIO (A2.8)
SX_MISO: 02_MCU (U4.35), 03_RADIO (A2.13)
SX_MOSI: 02_MCU (U4.36), 03_RADIO (A2.14)
SX_NRST: 02_MCU (U4.22), 03_RADIO (A2.4)
SX_NSS: 02_MCU (U4.37), 03_RADIO (A2.15)
SX_SCK: 02_MCU (U4.34), 03_RADIO (A2.12)
URX_MTX: 05_USB (U6.25), 02_MCU (U4.42)
UTX_MRX: 05_USB (U6.26), 02_MCU (U4.43)

## Assembly variants
BASIC_VARIANT: not fitted R26 R28 R30 R31 R32